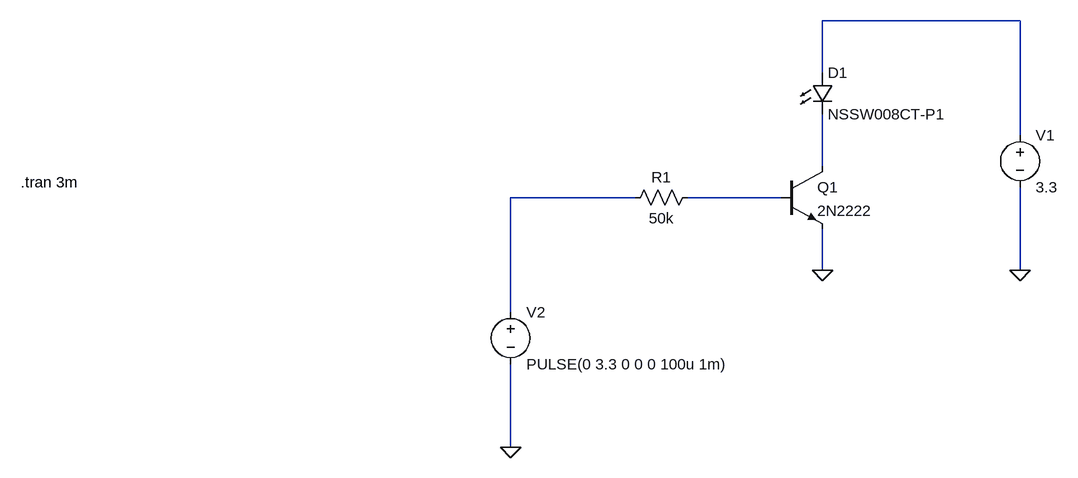
[diagram p0: schematic Draft1.asc]
Draft1.asc, the LTspice schematic file:
Version 4
SHEET 1 880 680
WIRE 592 -32 288 -32
WIRE 288 48 288 -32
WIRE 592 144 592 -32
WIRE 288 192 288 112
WIRE 0 240 -192 240
WIRE 224 240 80 240
WIRE 288 352 288 288
WIRE 592 352 592 224
WIRE -192 416 -192 240
WIRE -192 624 -192 496
FLAG 288 352 0
FLAG 592 352 0
FLAG -192 624 0
SYMBOL npn 224 192 R0
SYMATTR InstName Q1
SYMATTR Value 2N2222
SYMBOL res -16 256 R270
WINDOW 0 32 56 VTop 2
WINDOW 3 0 56 VBottom 2
SYMATTR InstName R1
SYMATTR Value 50k
SYMBOL LED 272 48 R0
SYMATTR InstName D1
SYMATTR Value NSSW008CT-P1
SYMATTR Description Diode
SYMATTR Type diode
SYMBOL voltage 592 128 R0
WINDOW 123 0 0 Left 0
WINDOW 39 0 0 Left 0
SYMATTR InstName V1
SYMATTR Value 3.3
SYMBOL voltage -192 400 R0
WINDOW 123 0 0 Left 0
WINDOW 39 0 0 Left 0
SYMATTR InstName V2
SYMATTR Value PULSE(0 3.3 0 0 0 100u 1m)
TEXT -946 216 Left 2 !.tran 3m

The netlist it stands for:
* Draft1.asc
Q1 N002 N004 0 0 2N2222
R1 N003 N004 50k
D1 N001 N002 NSSW008CT-P1
V1 N001 0 3.3
V2 N003 0 PULSE(0 3.3 0 0 0 100u 1m)
.model D D
.lib standard.dio
.model NPN NPN
.model PNP PNP
.lib standard.bjt
.tran 3m
.backanno
.end